# EAGLE design Memes (EAGLE 8.6.1)
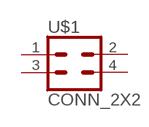
[diagram p0: schematic, sheet 1]

## Parts
U$1  CONN_2X2  [2X2_SMD]
Unconnected: U$1.1 U$1.2 U$1.3 U$1.4

## Library data of the parts
U$1 = SparkFun-Connectors:CONN_2X2

## Board
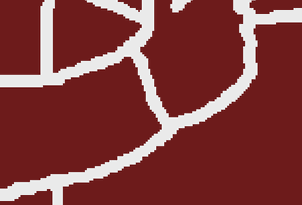
[diagram p1: board, top side]
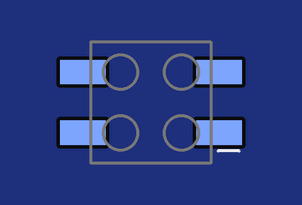
[diagram p2: board, bottom side, seen from below]

No outline drawn. Coordinates in mm, seen from the top.
Copper layers (1*16): Top 0.035mm / dielectric 1.5mm / Bottom 0.035mm
Design rules "default": minimum track width 6mil, minimum drill 0.35mm, track to track 6mil, track to pad 6mil, pad to pad 6mil, via to via 6mil, smd to smd 6mil, copper to edge 40mil, drill to drill 6mil, minimum pad ring 10mil, minimum via ring 8mil, stop-mask expansion 4mil, vias tented up to drill 0mil, thermal gap 10mil
Milling: 4 lines

### Footprints (pad centres in the part's own frame; a part is rotated, then mirrored left to right if it is on the bottom)
2X2_SMD = smd 1.02 x 1.9: 1 -1.27,-2.85; 2 -1.27,2.85; 3 1.27,-2.85; 4 1.27,2.85

### Placement (x,y rotation side)
U$1  22.44,5.08 90 bottom

### Tracks (layer width: path | path; a pad name or v marks a point on that pad's centre or on a via)
N$1
  pour Top: 0,36.83 0,0 44.45,0 44.45,36.83
N$2
  pour Bottom: 0,36.83 0,0 44.45,0 44.45,36.83